# EasyEDA schematic BB8_schematic.json

## Sheets
1 Sheet_1: TITLE: Sheet_1; REV: 1.0; Date: 2021-01-01; Sheet: 1/1; Drawn By: Stefan; Company: Your Company
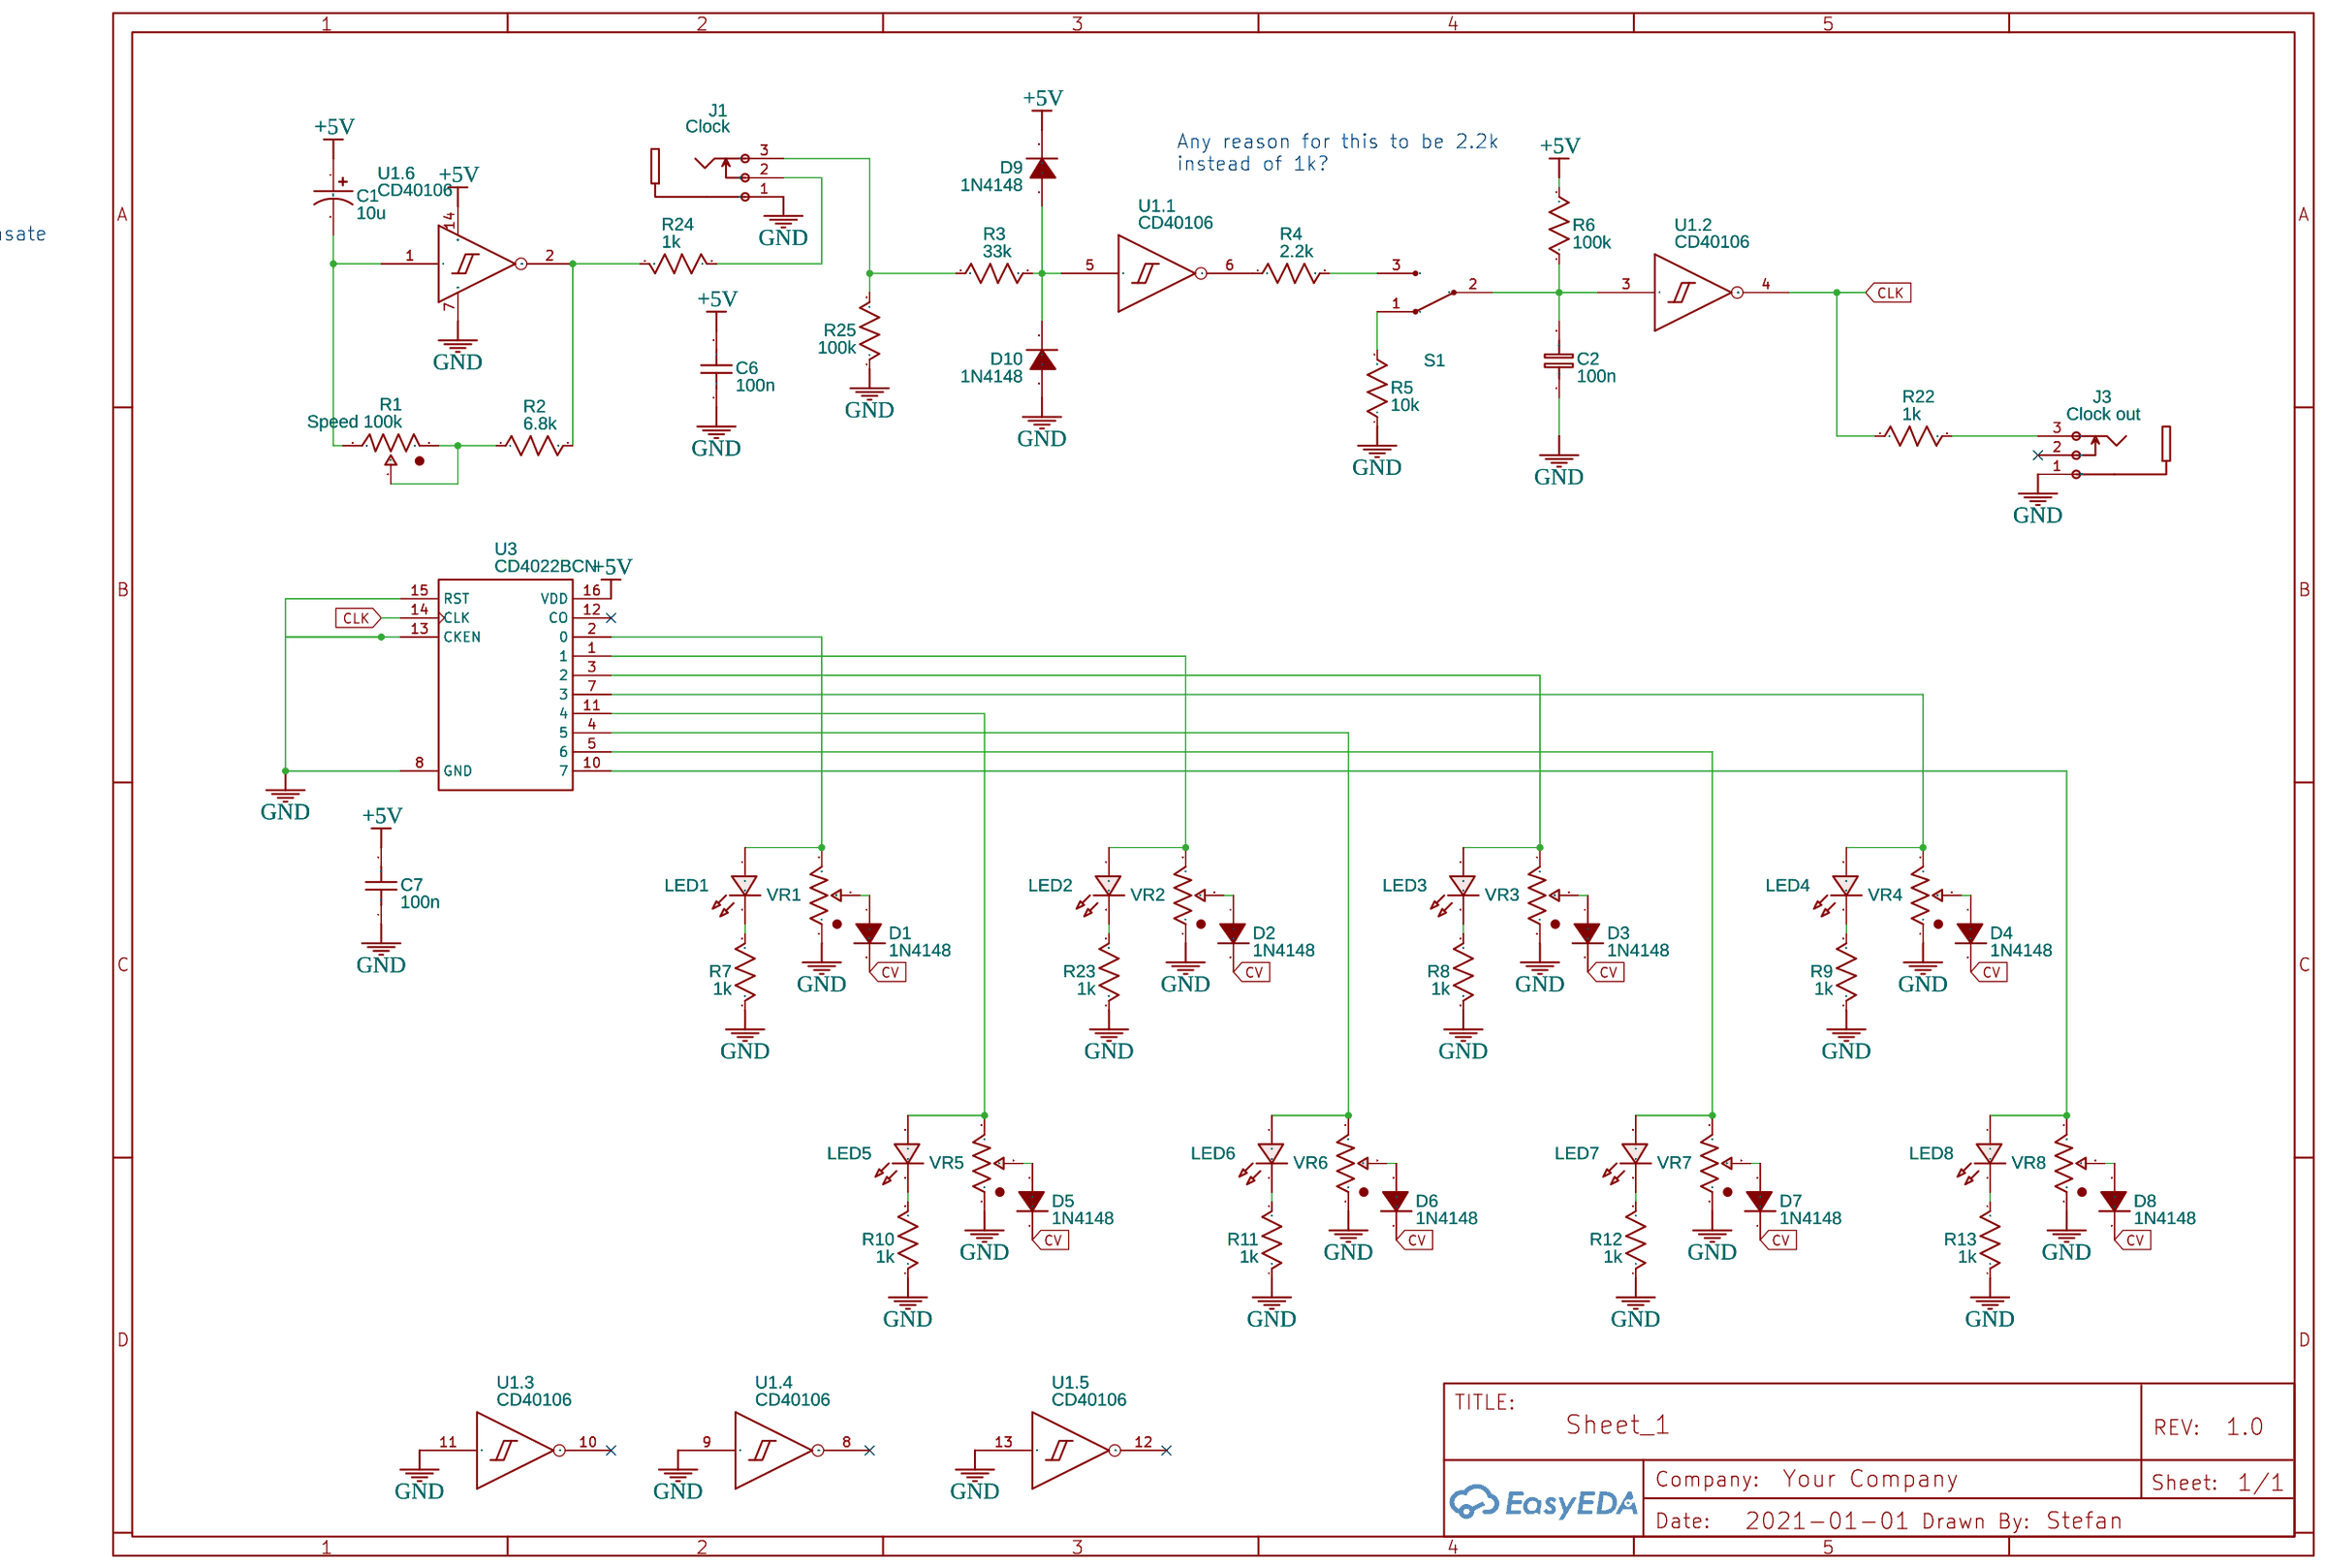
[diagram p0: Sheet_1]
2 Sheet_2: TITLE: Sheet_2
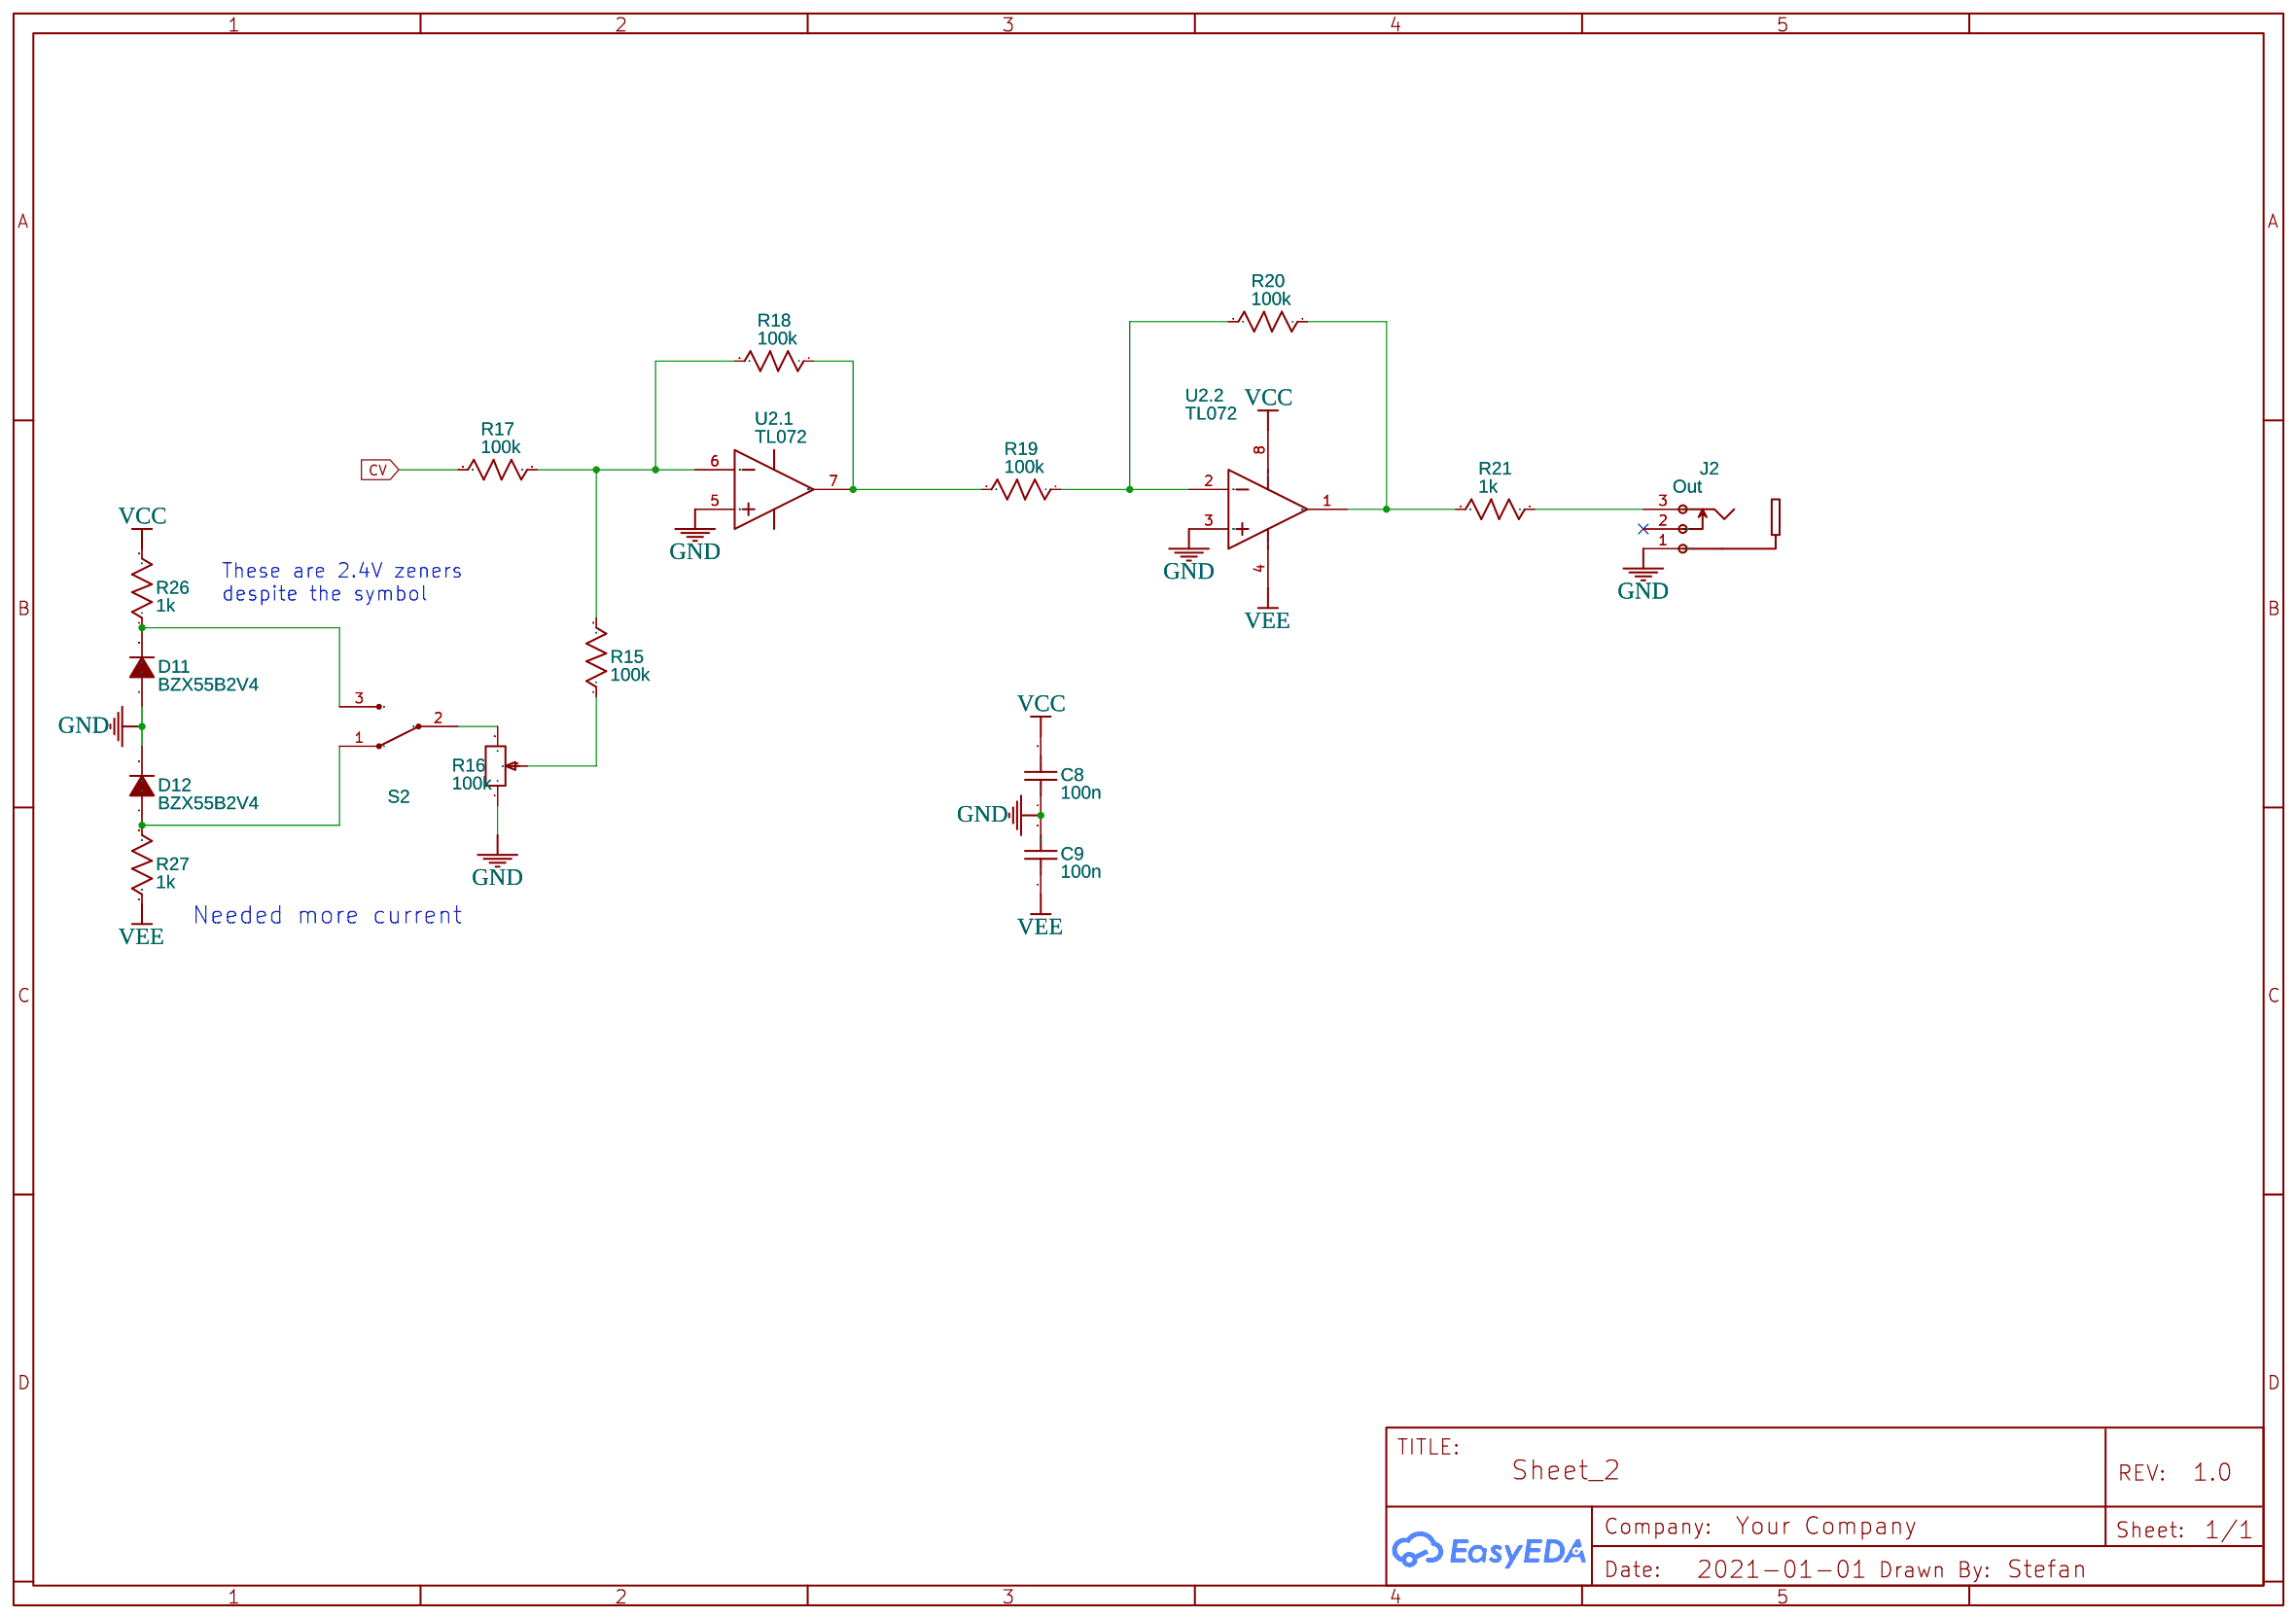
[diagram p1: Sheet_2]
3 Sheet_3: TITLE: Sheet_3; Date: 2021-01-02
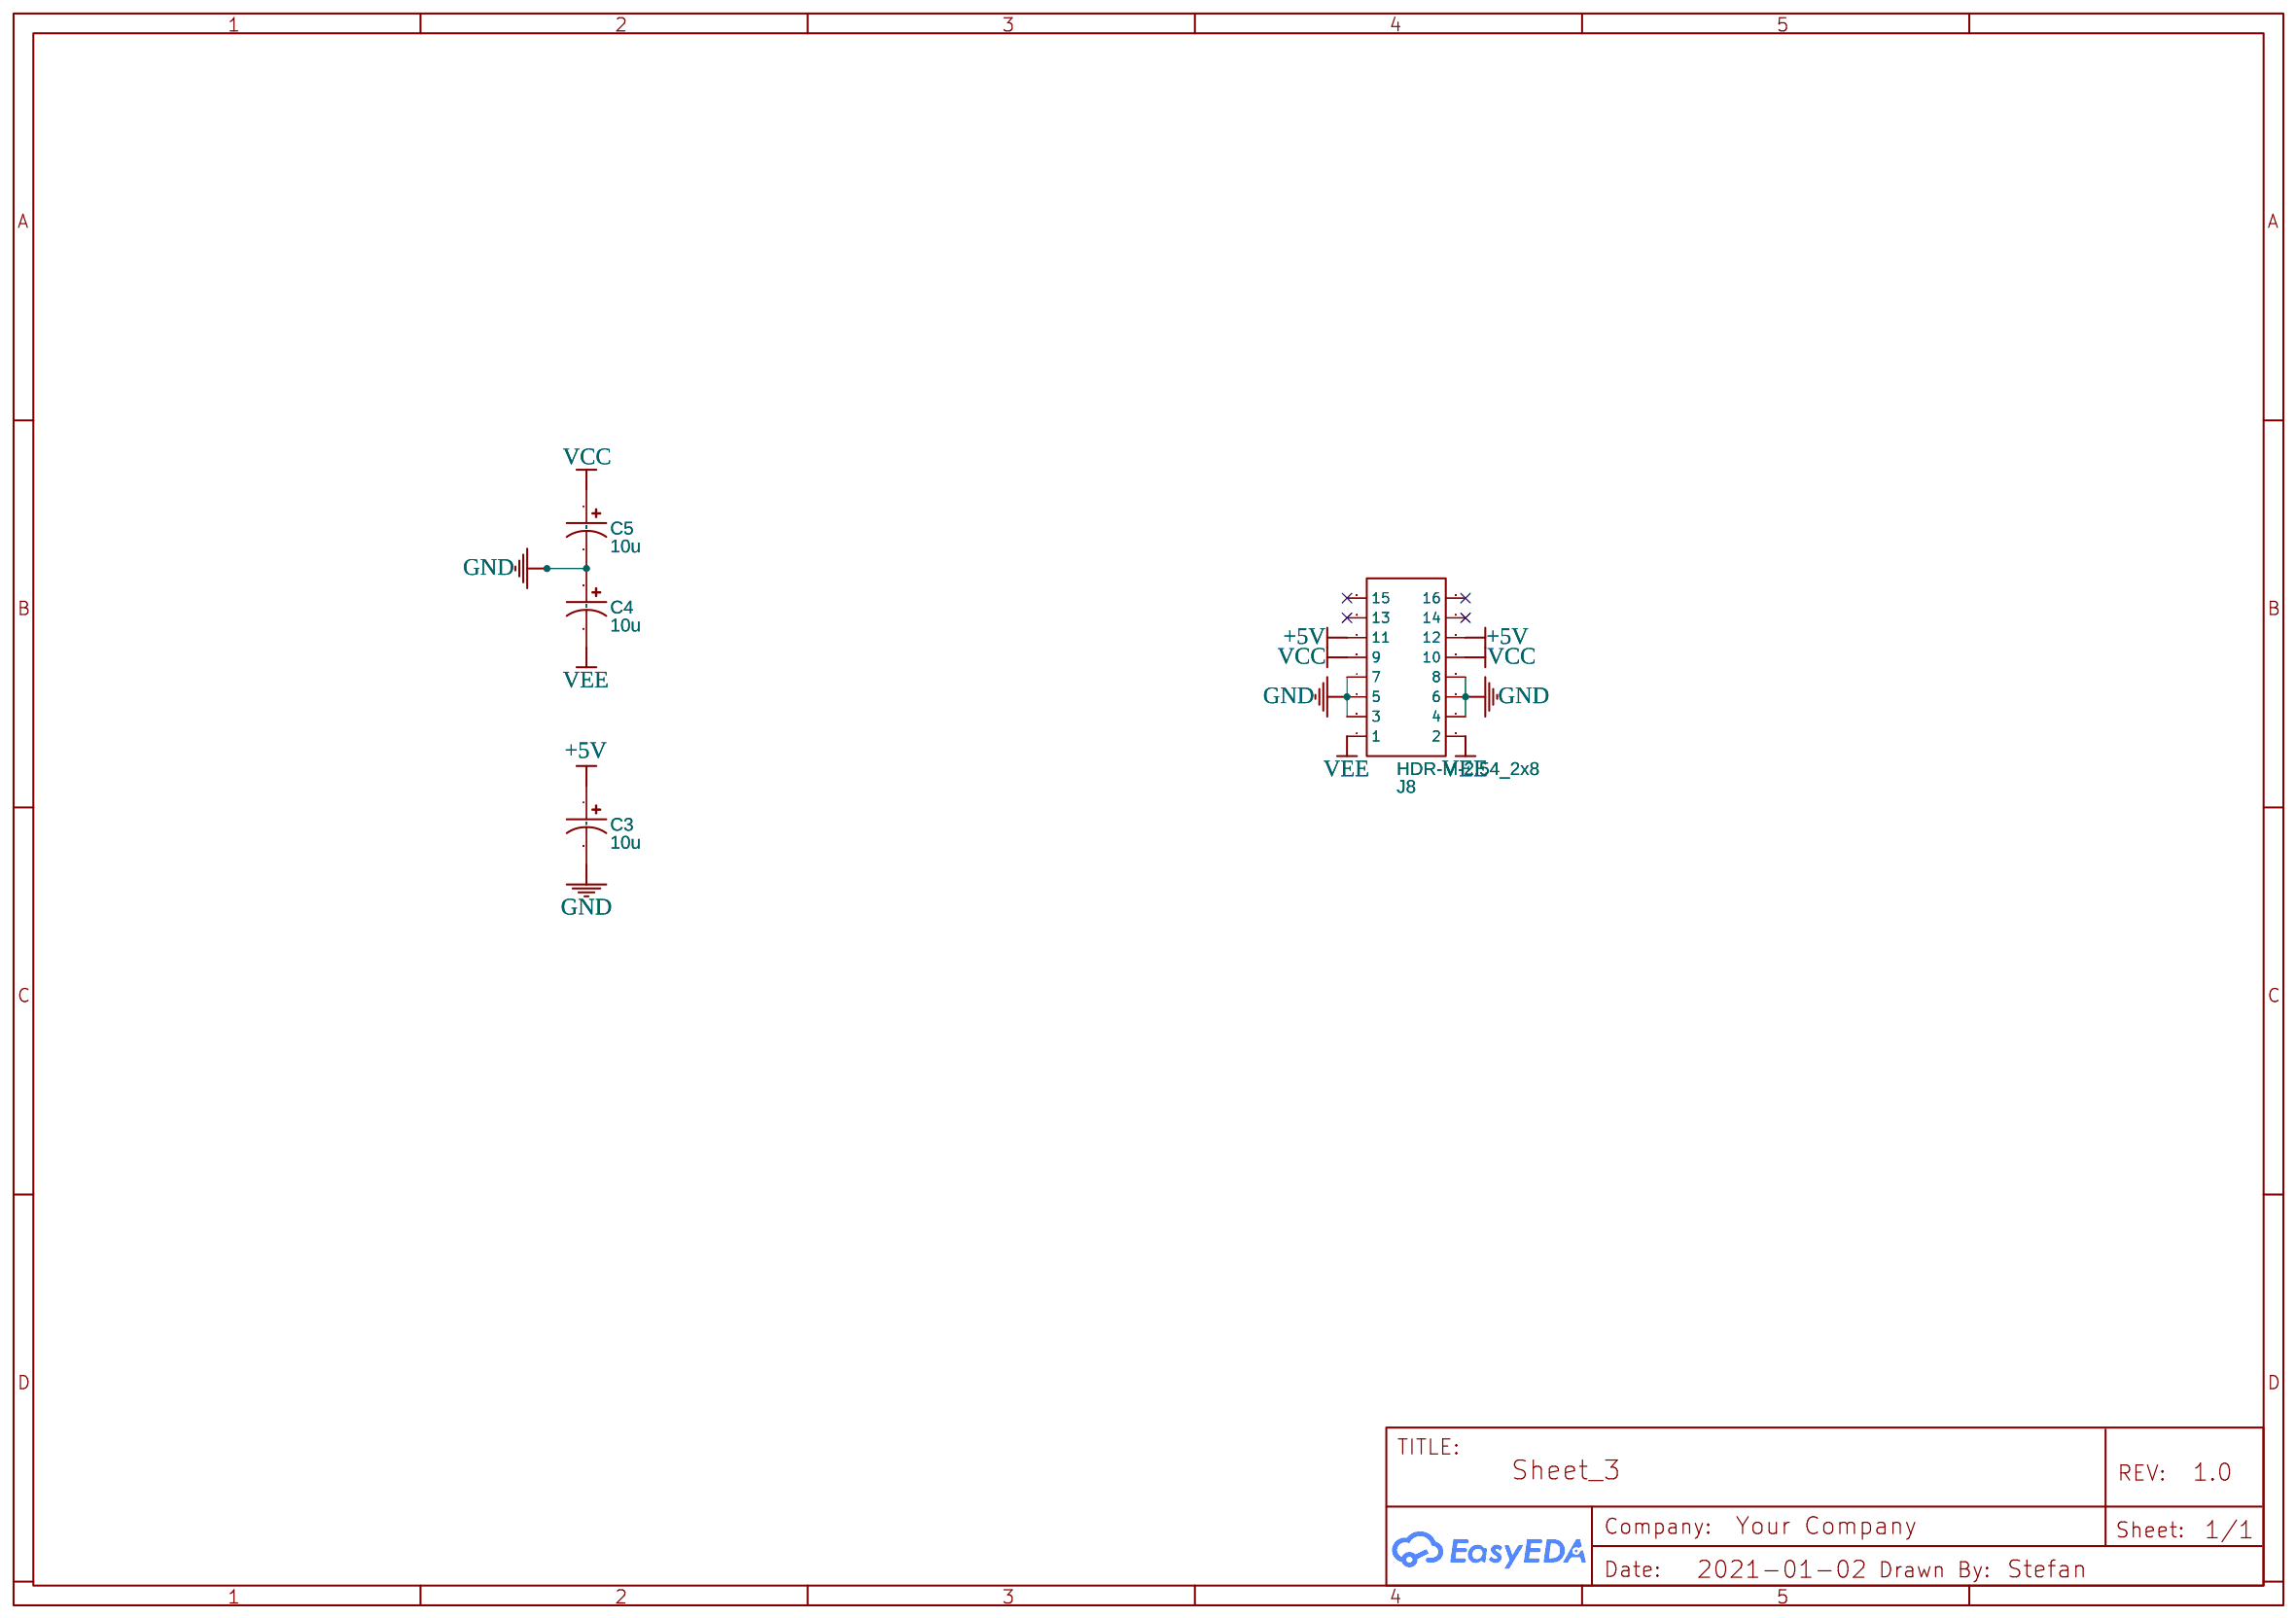
[diagram p2: Sheet_3]

## Parts
sheet Sheet_1
C1  10u  [CAP-D5.0×F2.0]
C2  100n  [RAD-0.1]
C6  100n  [RAD-0.1]
C7  100n  [RAD-0.1]
D1  1N4148  [1N4148]
D2  1N4148  [1N4148]
D3  1N4148  [1N4148]
D4  1N4148  [1N4148]
D5  1N4148  [1N4148]
D6  1N4148  [1N4148]
D7  1N4148  [1N4148]
D8  1N4148  [1N4148]
D9  1N4148  [1N4148]
D10  1N4148  [1N4148]
J1  Clock  [THONKICONN]
J3  Clock out  [THONKICONN]
LED1  LED-TH-3mm_R  [LED-TH_BD3.0_RED]
LED2  LED-TH-3mm_R  [LED-TH_BD3.0_RED]
LED3  LED-TH-3mm_R  [LED-TH_BD3.0_RED]
LED4  LED-TH-3mm_R  [LED-TH_BD3.0_RED]
LED5  LED-TH-3mm_R  [LED-TH_BD3.0_RED]
LED6  LED-TH-3mm_R  [LED-TH_BD3.0_RED]
LED7  LED-TH-3mm_R  [LED-TH_BD3.0_RED]
LED8  LED-TH-3mm_R  [LED-TH_BD3.0_RED]
R1  Speed 100k  [ALPHA9MM]
R2  6.8k  [R_AXIAL-0.3]
R3  33k  [R_AXIAL-0.3]
R4  2.2k  [R_AXIAL-0.3]
R5  10k  [R_AXIAL-0.3]
R6  100k  [R_AXIAL-0.3]
R7  1k  [R_AXIAL-0.3]
R8  1k  [R_AXIAL-0.3]
R9  1k  [R_AXIAL-0.3]
R10  1k  [R_AXIAL-0.3]
R11  1k  [R_AXIAL-0.3]
R12  1k  [R_AXIAL-0.3]
R13  1k  [R_AXIAL-0.3]
R22  1k  [R_AXIAL-0.3]
R23  1k  [R_AXIAL-0.3]
R24  1k  [R_AXIAL-0.3]
R25  100k  [R_AXIAL-0.3]
S1  SPDT MINI TOGGLE  [MINI SPDT]
U1  CD40106  [DIP14]  (sections 1,2,3,4,5,6)
U3  CD4022BCN  [DIP16]
VR1  ALPHA 9MM VERTICAL  [ALPHA9MM]
VR2  ALPHA 9MM VERTICAL  [ALPHA9MM]
VR3  ALPHA 9MM VERTICAL  [ALPHA9MM]
VR4  ALPHA 9MM VERTICAL  [ALPHA9MM]
VR5  ALPHA 9MM VERTICAL  [ALPHA9MM]
VR6  ALPHA 9MM VERTICAL  [ALPHA9MM]
VR7  ALPHA 9MM VERTICAL  [ALPHA9MM]
VR8  ALPHA 9MM VERTICAL  [ALPHA9MM]
sheet Sheet_2
C8  100n  [RAD-0.1]
C9  100n  [RAD-0.1]
D11  BZX55B2V4  [1N4148]
D12  BZX55B2V4  [1N4148]
J2  Out  [THONKICONN]
R15  100k  [R_AXIAL-0.3]
R16  100k  [RES-ADJ-TH_3296W]
R17  100k  [R_AXIAL-0.3]
R18  100k  [R_AXIAL-0.3]
R19  100k  [R_AXIAL-0.3]
R20  100k  [R_AXIAL-0.3]
R21  1k  [R_AXIAL-0.3]
R26  1k  [R_AXIAL-0.3]
R27  1k  [R_AXIAL-0.3]
S2  SPDT MINI TOGGLE  [MINI SPDT]
U2  TL072  [DIP8]  (sections 1,2)
sheet Sheet_3
C3  10u  [CAP-D5.0×F2.0]
C4  10u  [CAP-D5.0×F2.0]
C5  10u  [CAP-D5.0×F2.0]
J8  HDR-M-2.54_2x8  [PINSHRD_PTH_2X08]

## Library data of the parts
C1 = CE_TH_D5.0×F2.0_US: Contributor: LCEDA_Lib
C2 = C_RAD-0.1_EU: Contributor: LCEDA_Lib
C6-C9 = C_RAD-0.1_US: Contributor: LCEDA_Lib
D1-D10 = 1N4148: Supplier: LCSC; Manufacturer: SEMTECH; image: //image.lceda.cn/szlcsc/C14516.jpg; Supplier Part: C14516; Contributor: Vital_itpribor
J1-J3 = Thonkiconn: Manufacturer Part: Thonk; Contributor: Stefan
LED1-LED8 = LED-TH-3mm_R: Manufacturer: EVERLIGHT(台湾亿光); Manufacturer Part: 204-10SDRD/S530-A3-L; Supplier Part: C84774; Supplier: LCSC; Contributor: LCEDA_Lib
R1 VR1-VR8 = ALPHA 9MM VERTICAL: Manufacturer Part: Alpha 9mm; Contributor: Stefan
R2-R13 R15 R17-R25 = R_AXIAL-0.4_US: Contributor: LCEDA_Lib
S1 S2 = SPDT MINI TOGGLE: Manufacturer Part: SSSS811101; Contributor: njmattes; Supplier Part: 688-SSSS811101; Supplier: Mouser; link: https://www.mouser.com/datasheet/2/15/RKJ1-1370680.pdf
U1 = CD40106: Contributor: ConjuredCircuits; subpart_no: 5
U3 = CD4022BCN: Divide by 8 CounterDivider with 8 Decoded Outputs
D11 D12 = 1N4148: Contributor: Stefan
R16 = 3296W-1-202: Supplier: LCSC; Supplier Part: C330430; Manufacturer: Chengdu Guosheng Tech; Resistance(Ohms): 2K; Contributor: LCSC
R26 R27 = R_AXIAL-0.3_US: Contributor: LCEDA_Lib
U2 = TL072IP: Supplier Part: C110329; Supplier: LCSC; Manufacturer: TI; subpart_no: 2
C3-C5 = CE_TH_D3.0×F1.5_US: Contributor: LCEDA_Lib
J8 = HDR-M-2.54_2x8: Supplier Part: C68234; Supplier: LCSC; Contributor: LCEDA_Lib

## Nets
+5V: C1.1 C3.1 C6.2 C7.2 D9.2(C) J8.11 J8.12 R6.2 U1.14(VDD) U3.16(VDD)
GND: C2.1 C3.2 C4.1 C5.2 C6.1 C7.1 C8.1 C9.2 D10.1(A) D11.1(A) D12.2(C) J1.1(SLEVE/GND) J2.1(SLEVE/GND) J3.1(SLEVE/GND) J8.3 J8.4 J8.5 J8.6 J8.7 J8.8 R5.1 R7.1 R8.1 R9.1 R10.1 R11.1 R12.1 R13.1 R16.1 R23.1 R25.1 U1.7(VSS) U1.9(In) U1.11(In) U1.13(In) U2.3(IN1+) U2.5(IN2+) U3.8(GND) U3.13(CKEN) U3.15(RST) VR1.1 VR2.1 VR3.1 VR4.1 VR5.1 VR6.1 VR7.1 VR8.1
VCC: C5.1 C8.2 J8.9 J8.10 R26.2 U2.8(VCC+)
VEE: C4.2 C9.1 J8.1 J8.2 R27.1 U2.4(VCC-)
CLK: R22.1 U1.4(Out) U3.14(CLK)
CV: D1.2(C) D2.2(C) D3.2(C) D4.2(C) D5.2(C) D6.2(C) D7.2(C) D8.2(C) R17.2
Net-(C1-2): C1.2 R1.3 U1.1(In)
Net-(C2-2): C2.2 R6.1 S1.2 U1.3(In)
Net-(D1-1): D1.1(A) VR1.2
Net-(D2-1): D2.1(A) VR2.2
Net-(D3-1): D3.1(A) VR3.2
Net-(D4-1): D4.1(A) VR4.2
Net-(D5-1): D5.1(A) VR5.2
Net-(D6-1): D6.1(A) VR6.2
Net-(D7-1): D7.1(A) VR7.2
Net-(D8-1): D8.1(A) VR8.2
Net-(D9-1): D9.1(A) D10.2(C) R3.2 U1.5(In)
Net-(D11-2): D11.2(C) R26.1 S2.3
Net-(D12-1): D12.1(A) R27.2 S2.1
Net-(J1-2): J1.2(SWITCH) R24.1
Net-(J1-3): J1.3(TIP) R3.1 R25.2
Net-(J2-3): J2.3(TIP) R21.1
Net-(J3-3): J3.3(TIP) R22.2
Net-(LED1-1): LED1.1 U3.2(0) VR1.3
Net-(LED1-2): LED1.2 R7.2
Net-(LED2-1): LED2.1 U3.1 VR2.3
Net-(LED2-2): LED2.2 R23.2
Net-(LED3-1): LED3.1 U3.3(2) VR3.3
Net-(LED3-2): LED3.2 R8.2
Net-(LED4-1): LED4.1 U3.7(3) VR4.3
Net-(LED4-2): LED4.2 R9.2
Net-(LED5-1): LED5.1 U3.11(4) VR5.3
Net-(LED5-2): LED5.2 R10.2
Net-(LED6-1): LED6.1 U3.4(5) VR6.3
Net-(LED6-2): LED6.2 R11.2
Net-(LED7-1): LED7.1 U3.5(6) VR7.3
Net-(LED7-2): LED7.2 R12.2
Net-(LED8-1): LED8.1 U3.10(7) VR8.3
Net-(LED8-2): LED8.2 R13.2
Net-(R1-1): R1.1 R1.2 R2.1
Net-(R2-2): R2.2 R24.2 U1.2(Out)
Net-(R4-1): R4.1 U1.6(Out)
Net-(R4-2): R4.2 S1.3
Net-(R5-2): R5.2 S1.1
Net-(R15-1): R15.1 R16.2
Net-(R15-2): R15.2 R17.1 R18.2 U2.6(IN2-)
Net-(R16-3): R16.3 S2.2
Net-(R18-1): R18.1 R19.2 U2.7(OUT2)
Net-(R19-1): R19.1 R20.2 U2.2(IN1-)
Net-(R20-1): R20.1 R21.2 U2.1(OUT1)

Not connected (* = marked no-connect by the designer): J2 2(SWITCH)*; J3 2(SWITCH)*; J8 13* 14* 15* 16*; U1 8(Out)* 10(Out)* 12(Out)*; U3 12(CO)*

## Notes on the sheets
sheet 1
- Any reason for this to be 2.2k
  instead of 1k?
- Original was 100u
  Is that right?
  Resistors x10 to compensate
sheet 2
- These are 2.4V zeners
  despite the symbol
- Needed more current
